# EAGLE design magnetic-rotary-encoder (EAGLE 5.04)
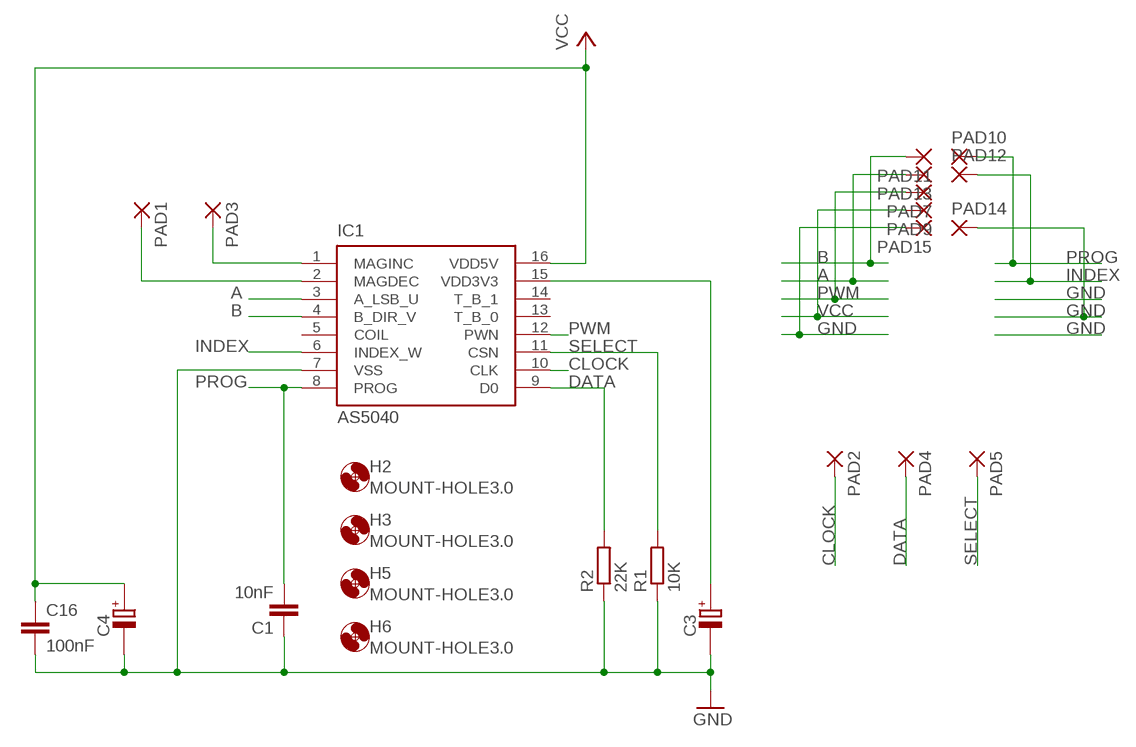
[diagram p0: schematic, sheet 1]

## Parts
C1  10nF  C-EUC1206K  [C1206K]
C3  POLARISED_A_CASE  [CAPMP3216X180N]
C4  POLARISED_A_CASE  [CAPMP3216X180N]
C16  100nF  C-EUC1206K  [C1206K]
H2  MOUNT-HOLE3.0  [3,0]
H3  MOUNT-HOLE3.0  [3,0]
H5  MOUNT-HOLE3.0  [3,0]
H6  MOUNT-HOLE3.0  [3,0]
IC1  AS5040  [SSOP16]
PAD1  1,6/0,9  [1,6/0,9]
PAD2  1,6/0,9  [1,6/0,9]
PAD3  1,6/0,9  [1,6/0,9]
PAD4  1,6/0,9  [1,6/0,9]
PAD5  1,6/0,9  [1,6/0,9]
PAD7  1,6/0,9  [1,6/0,9]
PAD9  1,6/0,9  [1,6/0,9]
PAD10  1,6/0,9  [1,6/0,9]
PAD11  1,6/0,9  [1,6/0,9]
PAD12  1,6/0,9  [1,6/0,9]
PAD13  1,6/0,9  [1,6/0,9]
PAD14  1,6/0,9  [1,6/0,9]
PAD15  1,6/0,9  [1,6/0,9]
R1  10K  R-EU_R0805  [R0805]
R2  22K  R-EU_R0805  [R0805]

## Nets
A: IC1.3(A_LSB_U) PAD13.1(P)
B: IC1.4(B_DIR_V) PAD11.1(P)
CLOCK: IC1.10(CLK) PAD2.1(P)
DATA: IC1.9(D0) PAD4.1(P) R2.2
GND: C1.1 C3.- C4.- C16.2 IC1.7(VSS) PAD14.1(P) PAD15.1(P) R1.1 R2.1
INDEX: IC1.6(INDEX_W) PAD12.1(P)
N$2: IC1.1(MAGINC) PAD3.1(P)
N$4: IC1.2(MAGDEC) PAD1.1(P)
N$8: C3.+ IC1.15(VDD3V3)
PROG: C1.2 IC1.8(PROG) PAD10.1(P)
PWM: IC1.12(PWN) PAD7.1(P)
SELECT: IC1.11(CSN) PAD5.1(P) R1.2
VCC: C4.+ C16.1 IC1.16(VDD5V) PAD9.1(P)
Unconnected: IC1.5(COIL) IC1.13(T_B_0) IC1.14(T_B_1)

## Library data of the parts
C1 C16 = rcl:C-EU: CAPACITOR, European symbol
C3 C4 = ipc-7351-capacitor:POLARISED_
H2 H3 H5 H6 = holes:MOUNT-HOLE: MOUNTING HOLE with drill center marker
IC1 = austriamicrosystems:AS5040: 10-BIT PROGRAMMABLE MAGNETIC ROTARY ENCODER Source: www.austriamicrosystems.com .. AS5040DataSheetRev12.pdf
PAD1-PAD5 PAD7 PAD9-PAD15 = wirepad:1,6/0,9: THROUGH-HOLE PAD
R1 R2 = rcl:R-EU_: RESISTOR, European symbol

## Board
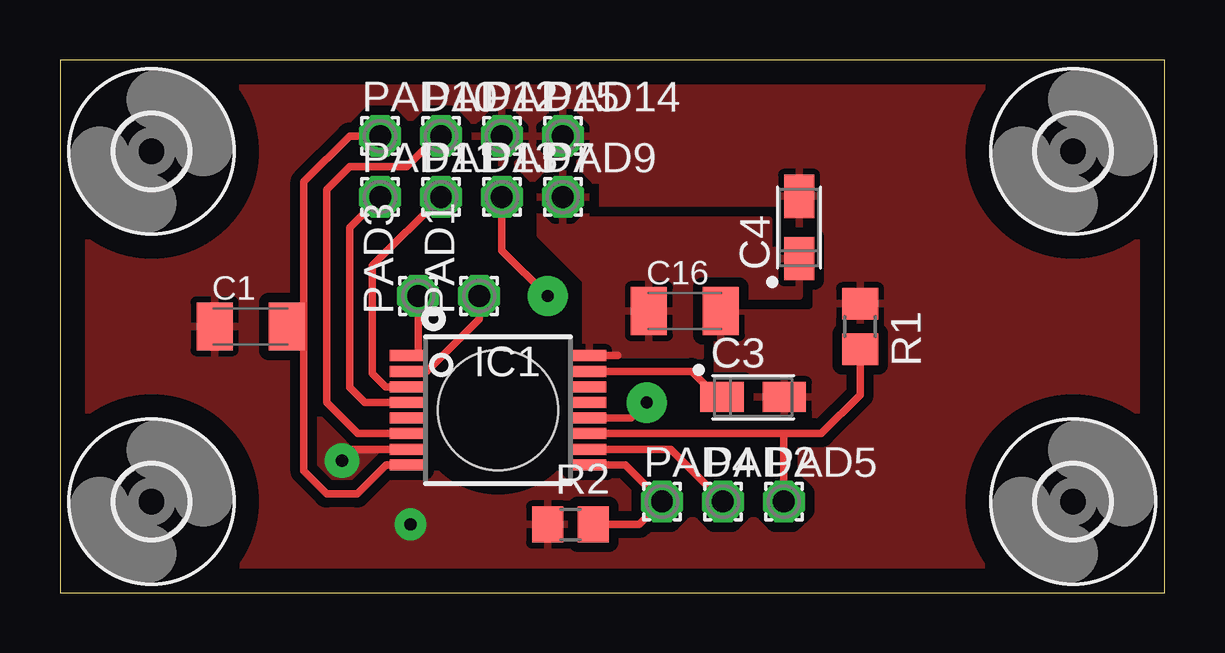
[diagram p1: board, top side]
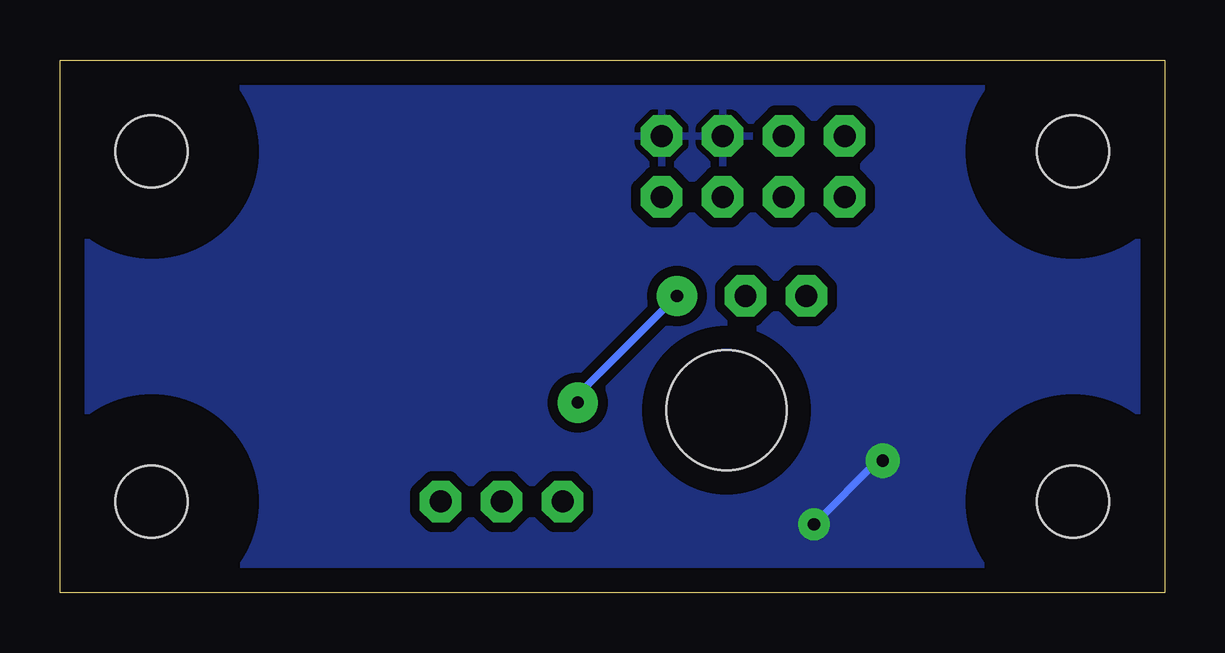
[diagram p2: board, bottom side, seen from below]

Size 46.02 x 22.23 mm. Coordinates in mm from the lower left corner, seen from the top.
Outline: 0,0 46.02,0 46.02,22.23 0,22.23 0,0
Copper layers (1*16): Top 0.035mm / dielectric 1.5mm / Bottom 0.035mm
Design rules "default *": minimum track width 12mil, minimum drill 32mil, track to track 11mil, track to pad 8mil, pad to pad 16mil, via to via 16mil, smd to smd 16mil, copper to edge 40mil, drill to drill 16mil, minimum pad ring 16mil, minimum via ring 16mil, stop-mask expansion 4mil, vias tented up to drill 0mil, thermal gap 10mil
Holes 5 mm at 18.25,7.62

### Footprints (pad centres in the part's own frame; a part is rotated, then mirrored left to right if it is on the bottom)
C1206K = smd 1.5 x 2: 1 -1.5,0; 2 1.5,0
CAPMP3216X180N = smd 1.8 x 1.25: + -1.3,0; - 1.3,0
3,0 = hole 3: 0,0
SSOP16 = smd 0.46 x 1.43: 1 -2.275,-3.795; 2 -1.625,-3.795; 3 -0.975,-3.795; 4 -0.325,-3.795; 5 0.325,-3.795; 6 0.975,-3.795; 7 1.625,-3.795; 8 2.275,-3.795; 9 2.275,3.795; 10 1.625,3.795; 11 0.975,3.795; 12 0.325,3.795; 13 -0.325,3.795; 14 -0.975,3.795; 15 -1.625,3.795; 16 -2.275,3.795
1,6/0,9 = drill 0.914 pad 1.6 octagon: 1 0,0
R0805 = smd 1.3 x 1.5: 1 -0.95,0; 2 0.95,0

### Placement (x,y rotation side)
C1  7.94,11.11 0 top
C3  28.88,8.17 0 top
C4  30.8,15.24 90 top
C16  26.04,11.75 0 top
H2  3.81,18.41 0 top
H3  42.22,18.41 0 top
H5  42.22,3.81 0 top
H6  3.81,3.81 0 top
IC1  18.25,7.62 270 top
PAD1  17.46,12.38 90 top
PAD2  27.62,3.81 0 top
PAD3  14.92,12.38 90 top
PAD4  25.08,3.81 0 top
PAD5  30.16,3.81 0 top
PAD7  18.41,16.51 0 top
PAD9  20.95,16.51 0 top
PAD10  13.34,19.05 0 top
PAD11  13.34,16.51 0 top
PAD12  15.88,19.05 0 top
PAD13  15.88,16.51 0 top
PAD14  20.95,19.05 0 top
PAD15  18.41,19.05 0 top
R1  33.34,11.11 270 top
R2  21.27,2.86 0 top

### Tracks (layer width: path | path; a pad name or v marks a point on that pad's centre or on a via)
A
  Top 0.305: IC1.3 13.58,8.6 13.02,9.16 13.02,13.65 PAD13.1
B
  Top 0.305: IC1.4 12.69,7.95 12.06,8.57 12.06,15.24 PAD11.1
CLOCK
  Top 0.305: IC1.10 25.44,6 PAD2.1
DATA
  Top 0.305: IC1.9 23.55,5.34 PAD4.1 24.13,2.86 R2.2
GND  (via drill 0.51, 0.51 pad 1.42)
  Top 0.305: IC1.7 12.22,6 v11.75,5.52
  Top 0.406: C3.- 30.16,8.18
  Bottom 0.305: v11.75,5.52 11.94,5.52 v14.61,2.86
  pour Bottom (isolate 0.406, rank 2): 0,22.23 46.02,22.23 46.02,0 0,0
  pour Top (isolate 0.406, rank 2): 0,22.23 46.02,22.23 46.02,0 0,0
INDEX
  Top 0.305: PAD12.1 15.71,19.05 14.44,17.78 12.06,17.78 11.11,16.83 11.11,7.94 12.4,6.64 IC1.6
N$2
  Top 0.305: IC1.1 14.92,9.89 PAD3.1
N$4
  Top 0.305: IC1.2 15.28,9.24 17.46,11.43 PAD1.1
N$8
  Top 0.305: IC1.15 26.32,9.24 27.39,8.17 C3.+
PROG
  Top 0.305: IC1.8 13.6,5.34 12.38,4.13 11.11,4.13 10.16,5.08 10.16,11.11 | PAD10.1 12.06,19.05 10.16,17.14 10.16,11.11 | 10.16,11.11 C1.2
PWM  (via drill 0.51 pad 1.68)
  Top 0.305: IC1.12 23.8,7.29 v24.45,7.94 | PAD7.1 18.41,14.29 v20.32,12.38
  Bottom 0.305: v24.45,7.94 24.45,8.26 v20.32,12.38
SELECT
  Top 0.305: 22.05,6.67 IC1.11 30.16,6.64 | 30.16,6.64 PAD5.1 | 30.16,6.64 31.73,6.64 33.34,8.26 R1.2
VCC
  Top 0.305: IC1.16 23.23,9.89
  pour Top (isolate 0.406): 20,16.83 20,14.92 21.91,13.02 21.91,9.84 26.67,9.84 26.67,12.38 30.8,12.38 30.8,14.29 29.53,14.29 29.53,15.56 21.91,15.56 21.91,16.83 21.27,17.46 20.64,17.46